# EAGLE design lunchbeats - amp (EAGLE 6.1)
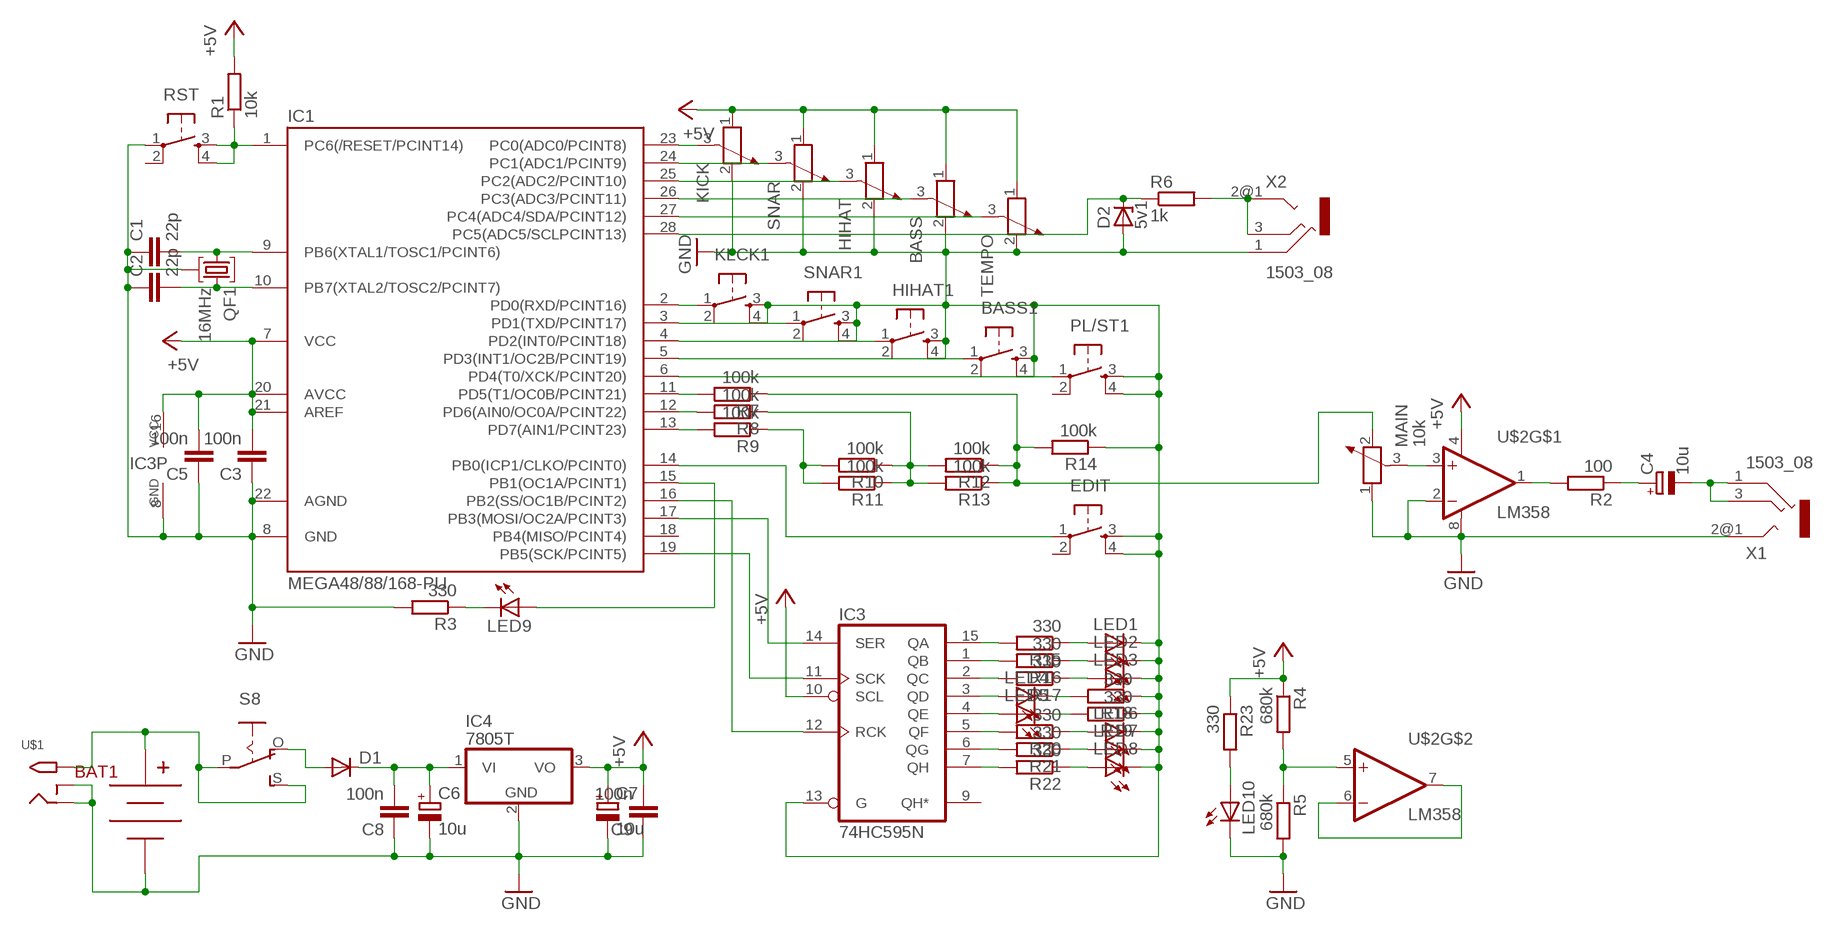
[diagram p0: schematic, sheet 1]

## Parts
BASS  POTENTIOMETER_PT-10  [PT-10]
BASS1  TAC_SWITCHPTH  [TACTILE-PTH]
BAT1  BC9VPC  [BC9VPC]
C1  22p  C-EU025-025X050  [C025-025X050]
C2  22p  C-EU025-025X050  [C025-025X050]
C3  100n  C-EU025-025X050  [C025-025X050]
C4  10u  CPOL-EUE2.5-6  [E2,5-6]
C5  100n  C-EU025-025X050  [C025-025X050]
C6  10u  CPOL-EUE2.5-5  [E2,5-5]
C7  10u  CPOL-EUE2.5-5  [E2,5-5]
C8  100n  C-EU025-025X050  [C025-025X050]
C9  100n  C-EU025-025X050  [C025-025X050]
D1  DIODE-D-5  [D-5]
D2  5v1  ZENER-DIODEZD-2.5  [ZDIO-2.5]
EDIT  TAC_SWITCHPTH  [TACTILE-PTH]
HIHAT  POTENTIOMETER_PT-10  [PT-10]
HIHAT1  TAC_SWITCHPTH  [TACTILE-PTH]
IC1  MEGA48/88/168-PU  [DIL28-3]
IC3  74HC595N  [DIL16]
IC4  7805T  [TO220H]
KICK  POTENTIOMETER_PT-10  [PT-10]
KLCK1  TAC_SWITCHPTH  [TACTILE-PTH]
LED1  LED5MM  [LED5MM]
LED2  LED5MM  [LED5MM]
LED3  LED5MM  [LED5MM]
LED4  LED5MM  [LED5MM]
LED5  LED5MM  [LED5MM]
LED6  LED5MM  [LED5MM]
LED7  LED5MM  [LED5MM]
LED8  LED5MM  [LED5MM]
LED9  LED5MM  [LED5MM]
LED10  LED5MM  [LED5MM]
MAIN  10k  POTENTIOMETER_PT-10  [PT-10]
PL/ST1  TAC_SWITCHPTH  [TACTILE-PTH]
QF1  16MHz  8M10AHC49T  [HC49U]
R1  10k  R-EU_0204/7  [0204/7]
R2  100  R-EU_0204/7  [0204/7]
R3  330  R-EU_0204/7  [0204/7]
R4  680k  R-EU_0204/5  [0204/5]
R5  680k  R-EU_0204/7  [0204/7]
R6  1k  R-EU_0204/7  [0204/7]
R7  100k  R-EU_0204/7  [0204/7]
R8  100k  R-EU_0204/7  [0204/7]
R9  100k  R-EU_0204/7  [0204/7]
R10  100k  R-EU_0204/7  [0204/7]
R11  100k  R-EU_0204/7  [0204/7]
R12  100k  R-EU_0204/7  [0204/7]
R13  100k  R-EU_0204/7  [0204/7]
R14  100k  R-EU_0204/7  [0204/7]
R15  330  R-EU_0204/7  [0204/7]
R16  330  R-EU_0204/7  [0204/7]
R17  330  R-EU_0204/7  [0204/7]
R18  330  R-EU_0204/7  [0204/7]
R19  330  R-EU_0204/7  [0204/7]
R20  330  R-EU_0204/7  [0204/7]
R21  330  R-EU_0204/7  [0204/7]
R22  330  R-EU_0204/7  [0204/7]
R23  330  R-EU_0204/5  [0204/5]
RST  TAC_SWITCHPTH  [TACTILE-PTH]
S8  EG1218S  [EG1218]
SNAR  POTENTIOMETER_PT-10  [PT-10]
SNAR1  TAC_SWITCHPTH  [TACTILE-PTH]
TEMPO  POTENTIOMETER_PT-10  [PT-10]
U$1  2.1MMJACKTHM  [PJ-102A]
U$2  LM358  [DIP08]
X1  1503_08  [1503_08]
X2  1503_08  [1503_08]

## Nets
+5V: BASS.1 C3.2 C5.2 C7.+ C9.2 HIHAT.1 IC1.7(VCC) IC1.20(AVCC) IC1.21(AREF) IC3.10(SCL) IC3.16(VCC) IC4.3(VO) KICK.1 R1.2 R4.1 R23.1 SNAR.1 TEMPO.1 U$2.4(V-)
GND: BASS1.3 BASS1.4 BASS.2 BAT1.V- C1.1 C2.1 C3.1 C5.1 C6.- C7.- C8.1 C9.1 D2.A EDIT.3 EDIT.4 HIHAT1.3 HIHAT1.4 HIHAT.2 IC1.8(GND) IC1.22(AGND) IC3.8(GND) IC3.13(G) IC4.2(GND) KICK.2 KLCK1.3 KLCK1.4 LED1.K(C) LED2.K(C) LED3.K(C) LED6.K(C) LED7.K(C) LED8.K(C) LED10.K(C) MAIN.1 PL/ST1.3 PL/ST1.4 QF1.2 R3.2 R5.2 R14.1 R18.1 R19.1 RST.1 SNAR1.3 SNAR1.4 SNAR.2 TEMPO.2 U$1.RING U$1.RING_SW U$2.2(-IN) U$2.8(V+) X1.2@1 X2.1
N$1: C1.2 IC1.9(PB6(XTAL1/TOSC1/PCINT6)) QF1.1
N$2: C2.2 IC1.10(PB7(XTAL2/TOSC2/PCINT7)) QF1.3
N$3: IC1.2(PD0(RXD/PCINT16)) KLCK1.1
N$4: IC3.3(QD) LED4.A
N$5: IC1.1(PC6(/RESET/PCINT14)) R1.1 RST.3 RST.4
N$6: IC1.23(PC0(ADC0/PCINT8)) KICK.3
N$7: IC1.24(PC1(ADC1/PCINT9)) SNAR.3
N$8: HIHAT.3 IC1.25(PC2(ADC2/PCINT10))
N$9: BASS.3 IC1.26(PC3(ADC3/PCINT11))
N$10: IC1.27(PC4(ADC4/SDA/PCINT12)) TEMPO.3
N$11: LED4.K(C) R18.2
N$12: IC3.4(QE) LED5.A
N$13: LED5.K(C) R19.2
N$14: R2.2 U$2.1(OUT)
N$15: IC1.11(PD5(T1/OC0B/PCINT21)) R7.2
N$16: IC1.12(PD6(AIN0/OC0A/PCINT22)) R8.2
N$17: IC1.13(PD7(AIN1/PCINT23)) R9.2
N$18: R9.1 R10.2 R11.2
N$19: R8.1 R10.1 R11.1 R12.2 R13.2
N$20: MAIN.2 R7.1 R12.1 R13.1 R14.2
N$21: EDIT.1 IC1.14(PB0(ICP1/CLKO/PCINT0))
N$22: C4.+ R2.1
N$23: IC3.15(QA) R15.2
N$24: IC3.1(QB) R16.2
N$25: IC3.2(QC) R17.2
N$26: MAIN.3 U$2.3(+IN)
N$27: C4.- X1.1 X1.3
N$28: IC3.5(QF) R20.2
N$29: IC3.6(QG) R21.2
N$30: IC3.7(QH) R22.2
N$31: LED1.A R15.1
N$32: LED2.A R16.1
N$33: LED3.A R17.1
N$34: IC1.15(PB1(OC1A/PCINT1)) LED9.A
N$35: LED9.K(C) R3.1
N$36: LED6.A R20.1
N$37: LED7.A R21.1
N$38: LED8.A R22.1
N$39: IC1.3(PD1(TXD/PCINT17)) SNAR1.1
N$40: HIHAT1.1 IC1.4(PD2(INT0/PCINT18))
N$41: IC1.17(PB3(MOSI/OC2A/PCINT3)) IC3.14(SER)
N$42: IC1.19(PB5(SCK/PCINT5)) IC3.11(SCK)
N$43: IC1.16(PB2(SS/OC1B/PCINT2)) IC3.12(RCK)
N$44: BASS1.1 IC1.5(PD3(INT1/OC2B/PCINT19))
N$45: C6.+ C8.2 D1.C IC4.1(VI)
N$46: BAT1.V+ S8.P S8.S U$1.TIP
N$47: D1.A S8.O
N$48: IC1.6(PD4(T0/XCK/PCINT20)) PL/ST1.1
N$49: R6.2 X2.2@1 X2.3
N$50: R4.2 R5.1 U$2.5(+IN)
N$51: U$2.6(-IN) U$2.7(OUT)
N$52: D2.C IC1.28(PC5(ADC5/SCLPCINT13)) R6.1
N$56: LED10.A R23.2
Unconnected: BASS1.2 EDIT.2 HIHAT1.2 IC1.18(PB4(MISO/PCINT4)) IC3.9(QH*) KLCK1.2 PL/ST1.2 RST.2 SNAR1.2 X1.2@2 X2.2@2

## Library data of the parts
BASS HIHAT KICK MAIN SNAR TEMPO = rcl:POTENTIOMETER_: Potentiometer
BASS1 EDIT HIHAT1 KLCK1 PL/ST1 RST SNAR1 = SparkFun-Electromechanical:TAC_SWITCH: Momentary Switch Button commonly used for reset or general input. Spark Fun Electronics SKU : COM-00097 SMT- SWCH-08247
BAT1 = SparkFun-Connectors:BC9VPC: 9V board-mount battery cradle
C1-C3 C5 C8 C9 = rcl:C-EU: CAPACITOR, European symbol
C4 C6 C7 = rcl:CPOL-EU: POLARIZED CAPACITOR, European symbol
D1 = diode:DIODE-: DIODE
D2 = diode:ZENER-DIODE: Z-Diode
IC1 = avr-5:MEGA48/88/168-PU
IC3 = 74xx-eu:74*595: 8-bit SHIFT REGISTER, output latch
IC4 = adafruit:78*: Positive VOLTAGE REGULATOR Added bigger pads to the TO-92 package
LED1-LED10 = led:LED: LED OSRAM: - CHIPLED LG R971, LG N971, LY N971, LG Q971, LY Q971, LO R971, LY R971 LH N974, LH R974 LS Q976, LO Q976, LY Q976 LO Q996 - Hyper CHIPLED LW Q18S LB Q993, LB Q99A, LB R99A - SideLED LS A670, LO A670, LY A670, LG A670, LP A670 LB A673, LV A673, LT A673, LW A673 LH A674 LY A675 LS A676, LA A676, LO A676, LY A676, LW A676 LS A679, LY A679, LG A679 - Hyper Micro SIDELED® LS Y876, LA Y876, LO Y876, LY Y876 LT Y87S - SmartLED LW L88C, LW L88S LB L89C, LB L89S, LG L890 LS L89K, LO L89K, LY L89K LS L896, LA L896, LO L896, LY L896 - TOPLED LS T670, LO T670, LY T670, LG T670, LP T670 LSG T670, LSP T670, LSY T670, LOP T670, LYG T670 LG T671, LOG T671, LSG T671 LB T673, LV T673, LT T673, LW T673 LH T674 LS T676, LA T676, LO T676, LY T676, LB T676, LH T676, LSB T676, LW T676 LB T67C, LV T67C, LT T67C, LS T67K, LO T67K, LY T67K, LW E67C LS E67B, LA E67B, LO E67B, LY E67B, LB E67C, LV E67C, LT E67C LW T67C LS T679, LY T679, LG T679 LS T770, LO T770, LY T770, LG T770, LP T770 LB T773, LV T773, LT T773, LW T773 LH T774 LS E675, LA E675, LY E675, LS T675 LS T776, LA T776, LO T776, LY T776, LB T776 LHGB T686 LT T68C, LB T68C - Hyper Mini TOPLED® LB M676 - Mini TOPLED Santana® LG M470 LS M47K, LO M47K, LY M47K Source: http://www.osram.convergy.de LUXEON: - LUMILED® LXK2-PW12-R00, LXK2-PW12-S00, LXK2-PW14-U00, LXK2-PW14-V00 LXK2-PM12-R00, LXK2-PM12-S00, LXK2-PM14-U00 LXK2-PE12-Q00, LXK2-PE12-R00, LXK2-PE12-S00, LXK2-PE14-T00, LXK2-PE14-U00 LXK2-PB12-K00, LXK2-PB12-L00, LXK2-PB12-M00, LXK2-PB14-N00, LXK2-PB14-P00, LXK2-PB14-Q00 LXK2-PR12-L00, LXK2-PR12-M00, LXK2-PR14-Q00, LXK2-PR14-R00 LXK2-PD12-Q00, LXK2-PD12-R00, LXK2-PD12-S00 LXK2-PH12-R00, LXK2-PH12-S00 LXK2-PL12-P00, LXK2-PL12-Q00, LXK2-PL12-R00 Source: www.luxeon.com KINGBRIGHT: KA-3528ASYC Source: www.kingbright.com
QF1 = crystal:8M10AHC49T: Monolithic Crystal Filters Source: www.vanlong.com; OC_FARNELL: unknown; OC_NEWARK: unknown
R1-R23 = rcl:R-EU_: RESISTOR, European symbol
S8 = adafruit:EG1218: SLIDING SWITCH 0.1" spacing through hole, vertical SPDT slide switch http://www.ladyada.net/library/pcb/eaglelibrary.html
U$1 = adafruit:2.1MMJACK: 2.1mm x 5.5mm THM DC jack with internal switch. Digikey part #PJ-102A, 4UCON part #05537 2.1mm x 5.5mm SMT DC jack with internal switch. Digikey part #PJ-002A-SMT, 4UCON part #03267 By microbuilder.eu & adafruit.com
U$2 = SparkFun:LM358
X1 X2 = con-lumberg:1503_?: Jack connectors according to JISC 6560, 3.5 mm Klinkensteckverbinder nach JISC 6560, 3,5 mm Source: http://www.lumberg.com/Produkte/PDFs/1503_08.pdf; OC_FARNELL: unknown; OC_NEWARK: unknown

## Board
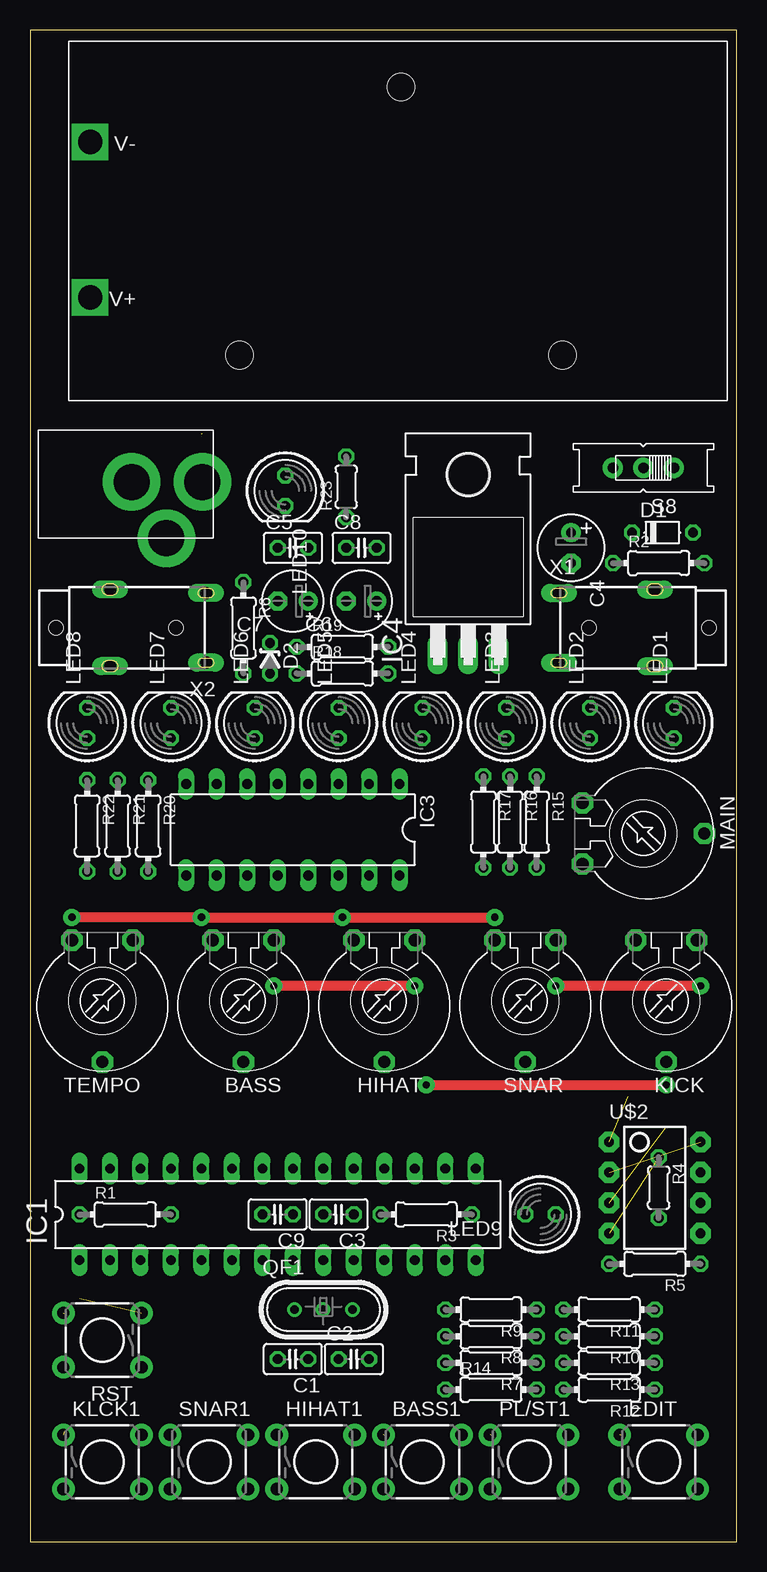
[diagram p1: board, top side]
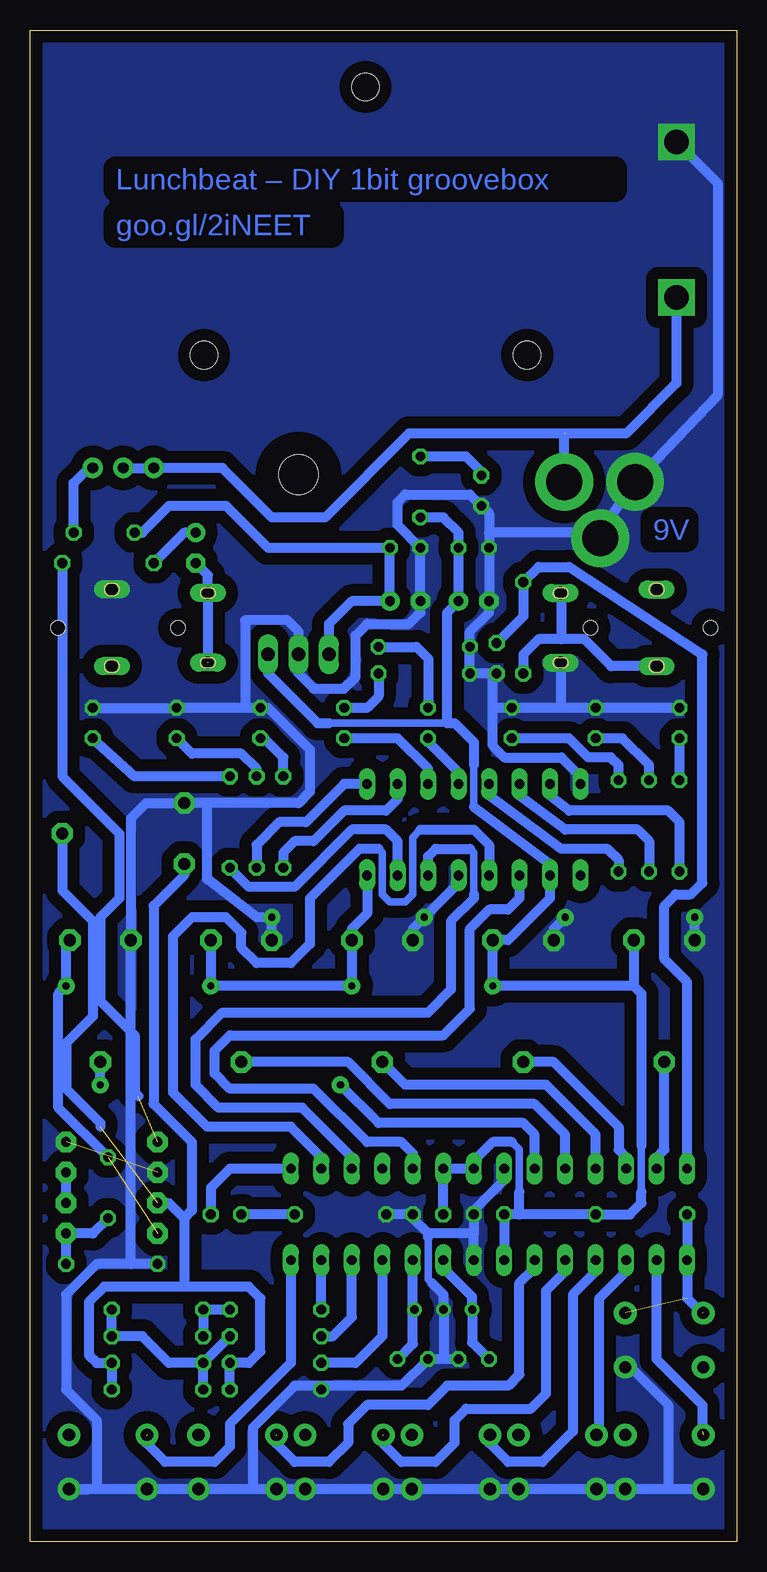
[diagram p2: board, bottom side, seen from below]

Size 58.89 x 126.03 mm. Coordinates in mm from the lower left corner, seen from the top.
Outline: 0,0 58.89,0 58.89,126.03 0,126.03 0,0
Copper layers (1*16): Top 0.035mm / dielectric 1.5mm / Bottom 0.035mm
Design rules: minimum track width 10mil, minimum drill 24mil, track to track 12mil, track to pad 12mil, pad to pad 12mil, via to via 12mil, smd to smd 10mil, copper to edge 12mil, drill to drill 12mil, minimum pad ring 10mil, minimum via ring 10mil, stop-mask expansion 4mil, vias tented up to drill 0mil, thermal gap 12mil

### Footprints (pad centres in the part's own frame; a part is rotated, then mirrored left to right if it is on the bottom)
PT-10 = drill 1.016 pad 1.778 octagon: 1 -2.54,-5.08; 2 2.54,-5.08; 3 0,5.08
TACTILE-PTH = drill 1.016 pad 1.88: 1 -3.251,2.261; 2 3.251,2.261; 3 -3.251,-2.261; 4 3.251,-2.261
BC9VPC = drill 2.032 square: V+ 53.086,21.336; V- 53.086,8.382 | hole 2.286: 27.178,3.81; 13.716,26.162; 40.64,26.162
C025-025X050 = drill 0.813 octagon: 1 -1.27,0; 2 1.27,0
E2,5-6 = drill 0.813 pad 1.6: + -1.27,0 | drill 0.813 pad 1.6 octagon: - 1.27,0
E2,5-5 = drill 0.813 pad 1.6: + -1.27,0 | drill 0.813 pad 1.6 octagon: - 1.27,0
D-5 = drill 0.813 octagon: A 2.54,0; C -2.54,0
ZDIO-2.5 = drill 0.813 octagon: A 1.27,0; C -1.27,0
DIL28-3 = drill 0.813 long: 1 -16.51,-3.81; 2 -13.97,-3.81; 3 -11.43,-3.81; 4 -8.89,-3.81; 5 -6.35,-3.81; 6 -3.81,-3.81; 7 -1.27,-3.81; 8 1.27,-3.81; 9 3.81,-3.81; 10 6.35,-3.81; 11 8.89,-3.81; 12 11.43,-3.81; 13 13.97,-3.81; 14 16.51,-3.81; 15 16.51,3.81; 16 13.97,3.81; 17 11.43,3.81; 18 8.89,3.81; 19 6.35,3.81; 20 3.81,3.81; 21 1.27,3.81; 22 -1.27,3.81; 23 -3.81,3.81; 24 -6.35,3.81; 25 -8.89,3.81; 26 -11.43,3.81; 27 -13.97,3.81; 28 -16.51,3.81
DIL16 = drill 0.813 long: 1 -8.89,-3.81; 2 -6.35,-3.81; 3 -3.81,-3.81; 4 -1.27,-3.81; 5 1.27,-3.81; 6 3.81,-3.81; 7 6.35,-3.81; 8 8.89,-3.81; 9 8.89,3.81; 10 6.35,3.81; 11 3.81,3.81; 12 1.27,3.81; 13 -1.27,3.81; 14 -3.81,3.81; 15 -6.35,3.81; 16 -8.89,3.81
TO220H = drill 1.118 long: 1 -2.54,-10.16; 2 0,-10.16; 3 2.54,-10.16 | hole 3.302: 0,4.826
LED5MM = drill 0.813 octagon: A -1.27,0; K 1.27,0
HC49U = drill 0.7 pad 1.2: 1 -2.413,0; 2 -0.027,0; 3 2.413,0
0204/7 = drill 0.813 octagon: 1 -3.81,0; 2 3.81,0
0204/5 = drill 0.813 octagon: 1 -2.54,0; 2 2.54,0
EG1218 = drill 0.9 pad 1.676: O -2.54,0; P 0,0; S 2.54,0
PJ-102A = drill 3 pad 4.8: RING 0.1,-3.39; RING_SW -4.6,-6.29; TIP 0.1,-9.29
DIP08 = drill 0.813 pad 1.727 octagon: 1 -3.81,-3.81; 2 -1.27,-3.81; 3 1.27,-3.81; 4 3.81,-3.81; 5 3.81,3.81; 6 1.27,3.81; 7 -1.27,3.81; 8 -3.81,3.81
1503_08 = drill 1 pad 1.2 long: 1 -2.9,-8; 2@1 -3.2,0; 2@2 3.2,0; 3 2.9,-8 | hole 1.2: 0,4.5; 0,-5.5

### Placement (x,y rotation side)
BASS  17.78,45.09 180 top
BASS1  32.7,6.67 0 top
BAT1  58.1,125.09 180 top
C1  21.91,15.24 180 top
C2  26.99,15.24 0 top
C3  25.72,27.3 180 top
C4  45.09,82.87 270 top
C5  21.91,82.87 0 top
C6  27.62,78.42 180 top
C7  21.91,78.42 180 top
C8  27.62,82.87 0 top
C9  20.64,27.3 180 top
D1  52.7,84.14 0 top
D2  20,73.66 270 top
EDIT  52.39,6.67 0 top
HIHAT  29.53,45.09 180 top
HIHAT1  23.81,6.67 0 top
IC1  20.64,27.3 0 top
IC3  21.91,59.37 180 top
IC4  36.51,84.14 0 top
KICK  53.02,45.09 180 top
KLCK1  6.03,6.67 0 top
LED1  53.66,68.26 90 top
LED2  46.67,68.26 90 top
LED3  39.69,68.26 90 top
LED4  32.7,68.26 90 top
LED5  25.72,68.26 90 top
LED6  18.73,68.26 90 top
LED7  11.75,68.26 90 top
LED8  4.76,68.26 90 top
LED9  42.55,27.3 180 top
LED10  21.27,87.63 270 top
MAIN  51.12,59.05 270 top
PL/ST1  41.59,6.67 0 top
QF1  24.45,19.37 0 top
R1  7.94,27.3 0 top
R2  52.39,81.6 0 top
R3  33.02,27.3 180 top
R4  52.39,29.53 270 top
R5  52.07,23.18 180 top
R6  17.78,76.2 270 top
R7  38.42,14.92 180 top
R8  38.42,17.14 180 top
R9  38.42,19.37 180 top
R10  48.26,17.14 180 top
R11  48.26,19.37 180 top
R12  48.26,12.7 180 top
R13  48.26,14.92 180 top
R14  38.42,12.7 0 top
R15  42.23,60.01 270 top
R16  40.01,60.01 270 top
R17  37.78,60.01 270 top
R18  26.04,72.39 0 top
R19  26.04,74.61 0 top
R20  9.84,59.69 270 top
R21  7.3,59.69 270 top
R22  4.76,59.69 270 top
R23  26.35,87.95 90 top
RST  6.03,16.83 180 top
S8  51.12,89.53 180 top
SNAR  41.27,45.09 180 top
SNAR1  14.92,6.67 0 top
TEMPO  6.03,45.09 180 top
U$1  5.08,88.27 90 top
U$2  52.07,29.53 270 top
X1  52.07,76.2 270 top
X2  6.67,76.2 90 top

### Tracks (layer width: path | path; a pad name or v marks a point on that pad's centre or on a via)
+5V  (via drill 0.6 pad 1.42)  (1 unrouted)
  Top 0.813: v55.88,46.35 v43.81,46.35 | v32.07,46.35 v20.32,46.35
  Bottom 0.61: 21.91,64.77 21.91,61.28 | 18.1,29.21 18.1,32.7 18.73,33.34 | 7.94,33.02 7.94,29.21 | 33.97,68.26 24.13,68.26
  Bottom 0.813: IC3.16 30.8,52.39 32.07,51.12 HIHAT.1 v32.07,46.35 v43.81,46.35 SNAR.1 | 21.91,61.28 15.56,56.52 IC3.10 15.56,53.66 19.05,50.16 BASS.1 v20.32,46.35 8.57,46.35 | C3.2 IC1.20 IC1.21 21.91,31.75 20.32,33.34 18.73,33.34 | KICK.1 55.88,49.85 v55.88,46.35 56.52,45.72 56.52,36.2 R4.1 | R1.2 18.1,27.3 | 7.94,29.21 7.94,28.26 8.89,27.3 R1.2 | IC4.3 39.05,72.39 34.92,68.26 33.97,68.26 | 21.91,64.77 21.91,66.67 23.5,68.26 24.13,68.26 24.13,77.47 C7.+ C5.2 23.18,84.14 24.45,85.41 R23.1 | IC1.7 C9.2 18.1,27.3 | 18.1,27.3 18.1,29.21 | 7.94,33.02 7.94,45.72 8.57,46.35 | R1.2 12.06,27.3 | TEMPO.1 8.57,46.35
GND  (via drill 0.6 pad 1.42)  (1 unrouted)
  Top 0.813: v38.73,52.07 v26.04,52.07 v14.29,52.07 v3.49,52.07
  Bottom 0.61: 25.72,25.4 25.72,21.91 25.4,21.59
  Bottom 0.813: LED8.K LED7.K 14.61,69.53 | 14.61,69.53 LED6.K 20.32,69.53 | 40.96,69.53 LED3.K 39.05,69.53 35.56,66.04 35.56,62.55 36.51,61.59 44.13,61.59 | 40.96,69.53 LED2.K LED1.K | 24.42,15.27 QF1.2 24.42,20.61 25.4,21.59 | 24.42,15.27 24.77,15.24 C2.1 27.94,13.02 34.61,13.02 | C1.1 24.39,15.24 24.42,15.27 | SNAR.2 v38.73,52.07 40.01,52.07 44.13,55.24 44.13,61.59 | IC3.8 13.02,63.82 14.61,65.41 19.37,65.41 20.32,66.36 20.32,69.53 | IC3.13 23.18,54.93 v26.04,52.07 26.99,51.12 HIHAT.2 | 25.72,25.4 25.72,25.72 | IC1.8 21.91,25.72 | 21.91,25.72 25.72,25.72 | 50.48,23.18 KICK.2 50.48,60.33 49.21,61.59 MAIN.1 44.13,61.59 | v14.29,52.07 15.24,51.12 BASS.2 | 40.96,69.53 40.96,76.83 37.47,76.83 36.51,75.88 IC4.2 36.51,72.39 35.24,71.12 32.7,71.12 31.75,72.07 31.75,75.56 30.8,76.52 27.3,76.52 26.35,77.47 C6.- C8.1 28.26,84.77 28.26,86.68 27.62,87.31 22.23,87.31 LED10.K 20.64,85.72 20.64,84.14 | BAT1.V- 1.59,113.28 1.59,95.56 U$1.RING 11.43,84.14 20.64,84.14 | 34.61,13.02 36.83,13.02 40.32,9.53 40.32,4.41 | 20.64,84.14 C5.1 C7.- 20.64,77.47 22.23,75.88 R19.1 R18.1 D2.A 20.32,72.07 20.32,69.53 | IC1.22 19.37,30.16 21.91,27.62 C9.1 21.91,25.72 | X2.1 14.67,69.59 14.61,69.53 | R5.2 50.48,23.18 | 50.48,23.18 53.34,23.18 55.88,20.64 55.88,12.7 53.34,10.16 53.34,4.45 54.01,4.41 EDIT.4 EDIT.3 PL/ST1.4 40.32,4.41 | KLCK1.3 5.71,4.41 | 5.71,4.41 KLCK1.4 SNAR1.3 SNAR1.4 HIHAT1.3 HIHAT1.4 BASS1.3 BASS1.4 PL/ST1.3 40.32,4.41 | 5.71,4.41 5.71,11.43 8.97,14.68 RST.1 | R14.1 34.61,13.02 | 25.72,25.72 26.99,26.99 C3.1 R3.2 | TEMPO.2 v3.49,52.07
  pour Bottom (isolate 1.016, no thermals): 0,0 58.74,0 58.74,126.05 0,126.05
N$1
  Bottom 0.813: C1.2 22.04,16.64 QF1.1 22.04,20.45 24.45,22.86 IC1.9
N$2
  Bottom 0.813: C2.2 26.99,16.51 26.99,19.37 | 26.99,19.37 IC1.10 | QF1.3 26.99,19.37
N$3  (1 unrouted)
  Bottom 0.813: IC1.2 6.67,15.24 2.86,11.43 2.86,9.21
N$4
  Bottom 0.813: LED4.A 28.26,66.99 25.72,64.45 IC3.3
N$5  (2 unrouted)
  Bottom 0.813: R1.1 IC1.1 | 4.09,23.46 IC1.1 | IC1.1 4.13,20.32 2.86,19.05
N$6  (via drill 0.6 pad 1.42)
  Top 0.813: v33.02,38.1 v53.02,38.1
  Bottom 0.813: v53.02,38.1 KICK.3 | IC1.23 16.83,33.97 17.78,34.92 29.84,34.92 v33.02,38.1
N$7
  Bottom 0.813: SNAR.3 32.38,40.01 28.89,36.51 16.83,36.51 14.29,33.97 IC1.24
N$8
  Bottom 0.813: IC1.25 11.75,33.97 15.88,38.1 27.62,38.1 HIHAT.3
N$9
  Bottom 0.813: BASS.3 15.24,40.01 9.84,34.61 9.84,32.7 9.21,32.07 IC1.26
N$10
  Bottom 0.813: IC1.27 6.67,32.07 6.03,32.7 TEMPO.3
N$11
  Bottom 0.813: R18.2 29.84,70.48 30.8,69.53 LED4.K
N$12
  Bottom 0.813: IC3.4 23.18,64.14 25.72,66.67 LED5.A
N$13
  Bottom 0.813: R19.2 26.67,74.61 25.72,73.66 LED5.K
N$14  (1 unrouted)
  Bottom 0.813: R2.2 56.2,63.82 51.44,59.05 51.44,53.66 53.02,52.07 53.02,45.09 50.16,42.23 50.16,37.47 49.85,37.15
N$15
  Bottom 0.813: IC1.11 29.53,17.14 31.75,14.92 R7.2
N$16
  Bottom 0.813: R8.2 33.66,17.14 32.07,18.73 IC1.12
N$17
  Bottom 0.813: R9.2 IC1.13
N$18
  Bottom 0.813: R10.2 R11.2 R9.1
N$19
  Bottom 0.813: R12.2 R13.2 | R8.1 R13.2 | R13.2 47.31,14.92 49.53,17.14 R10.1 R11.1
N$20
  Bottom 0.813: R12.1 R13.1 53.34,14.92 53.98,15.56 53.98,20 52.7,21.27 46.04,21.27 | R14.2 R7.1 40.64,14.92 39.69,15.88 39.69,20.32 40.64,21.27 46.04,21.27 | 47.31,28.26 46.04,26.99 | 46.04,26.99 46.04,21.27 | MAIN.2 46.04,55.56 48.58,53.02 48.58,36.51 45.4,33.34 45.4,27.62 46.04,26.99
N$21  (1 unrouted)
  Bottom 0.813: 49.21,8.89 49.21,8.26 47.62,6.67 43.5,6.67 42.23,7.94 42.23,9.84 37.15,14.92 IC1.14
N$22
  Bottom 0.813: C4.+ 46.04,84.14 R2.1
N$23
  Bottom 0.813: IC3.15 28.26,58.42 29.21,59.37 32.07,59.37 36.83,54.61 40.64,54.61 R15.2
N$24
  Bottom 0.813: IC3.1 32.7,63.18 35.88,60.01 38.1,60.01 40.01,58.1 R16.2
N$25
  Bottom 0.813: IC3.2 28.26,61.91 29.21,60.96 32.7,60.96 35.24,58.42 36.83,58.42 37.78,57.47 R17.2
N$26  (1 unrouted)
  Bottom 0.813: MAIN.3 56.2,54.29 53.66,51.75 53.66,43.81 55.88,41.59 55.88,37.78 53.02,34.92 53.02,34.61
N$27  (1 unrouted)
  Bottom 0.813: C4.- 44.07,80.58 X1.1 44.07,73.41 44.13,73.34
N$28
  Bottom 0.813: IC3.5 20.64,62.23 14.61,57.78 10.79,57.78 9.84,56.83 R20.2
N$29
  Bottom 0.813: IC3.6 18.1,62.23 14.29,59.37 8.26,59.37 7.3,58.42 R21.2
N$30
  Bottom 0.813: R22.2 4.76,60.01 5.71,60.96 13.97,60.96 15.56,62.23 IC3.7
N$31
  Bottom 0.813: LED1.A 50.16,63.82 R15.1
N$32
  Bottom 0.813: LED2.A 45.4,65.72 41.27,65.72 40.01,64.45 R16.1
N$33
  Bottom 0.813: R17.1 37.78,65.41 39.37,66.99 LED3.A
N$34
  Bottom 0.813: IC1.15 42.23,31.11 43.81,29.53 LED9.A
N$35
  Bottom 0.813: R3.1 LED9.K
N$36
  Bottom 0.813: LED6.A 13.97,66.99 12.38,65.41 10.48,65.41 9.84,64.77 R20.1
N$37
  Bottom 0.813: R21.1 7.3,64.77 9.53,66.99 LED7.A
N$38
  Bottom 0.813: R22.1 LED8.A
N$39
  Bottom 0.813: IC1.3 9.21,22.54 11.43,20.32 11.43,9.21 11.67,8.97 SNAR1.1
N$40
  Bottom 0.813: IC1.4 11.75,22.54 13.65,20.64 13.65,9.21 16.19,6.67 19.05,6.67 20.64,8.26 20.64,8.85 HIHAT1.1
N$41
  Bottom 0.61: 21.91,53.98 21.91,57.47 22.23,57.78
  Bottom 0.813: IC1.17 32.07,32.07 36.2,36.2 43.18,36.2 45.09,38.1 45.09,41.91 42.86,44.13 25.72,44.13 23.81,46.04 23.81,51.75 21.91,53.66 21.91,53.98 | IC3.14 25.72,57.15 25.08,57.78 22.23,57.78
N$42
  Bottom 0.813: IC3.11 18.1,53.66 19.05,52.7 20.64,52.7 22.23,51.12 22.23,44.45 24.45,42.23 42.23,42.23 43.5,40.96 43.5,39.05 42.23,37.78 35.24,37.78 30.8,33.34 27.94,33.34 26.99,32.38 IC1.19
N$43
  Bottom 0.61: 29.84,57.78 29.53,57.47 29.53,53.98 28.89,53.34 27.62,53.34 26.99,53.98 26.99,58.74 26.35,59.37
  Bottom 0.813: 26.35,59.37 21.91,59.37 20.64,58.1 IC3.12 | 29.84,57.78 31.43,57.78 35.56,53.66 35.56,49.85 37.15,48.26 40.01,48.26 41.27,49.53 41.27,50.8 42.55,52.07 45.4,52.07 46.99,50.48 46.99,37.47 44.13,34.61 37.15,34.61 34.61,32.07 IC1.16
N$44  (1 unrouted)
  Bottom 0.813: IC1.5 14.29,22.54 15.88,20.95 15.88,12.38 17.14,11.11 22.54,11.11 23.5,10.16 23.5,8.26 25.08,6.67 27.94,6.67 29.53,8.26 29.53,8.89
N$45
  Bottom 0.813: D1.C 49.53,84.14 47.31,86.36 42.55,86.36 39.05,82.87 C8.2 C6.+ 32.07,78.42 33.97,76.52 IC4.1
N$46  (1 unrouted)
  Bottom 0.813: S8.P S8.S 42.86,89.53 38.73,85.41 34.29,85.41 27.3,92.39 14.37,92.39 U$1.TIP | BAT1.V+ 5.02,96.58 9.21,92.39 14.29,92.39
N$47
  Bottom 0.813: D1.A 55.24,88.27 53.98,89.53 S8.O
N$48  (1 unrouted)
  Bottom 0.813: IC1.6 16.83,22.86 18.1,21.59 18.1,13.97 19.05,13.02 24.13,13.02 25.72,11.43 30.8,11.43 32.38,9.84 32.38,8.26 33.97,6.67 36.83,6.67 38.42,8.26 38.42,8.89
N$49
  Bottom 0.813: X2.2@1 10.45,73 12.7,75.25 14.61,75.25 | 14.61,75.25 16.51,75.25 17.78,73.98 R6.2 | X2.3 14.65,79.1 14.61,79.06 14.61,75.25
N$50
  Bottom 0.813: R5.1 U$2.5 53.66,25.72 R4.2
N$51
  Bottom 0.813: U$2.6 U$2.7
N$52
  Bottom 0.813: IC1.28 4.13,46.67 6.03,48.58 6.03,53.02 5.08,53.98 3.81,53.98 2.86,54.93 2.86,73.98 13.97,81.28 16.51,81.28 R6.1 17.78,77.15 D2.C
N$56
  Bottom 0.813: LED10.A 21.27,89.22 22.54,90.49 R23.2

### Text on the board
Bottom: Lunchbeat – DIY 1bit groovebox | goo.gl/2iNEET | 9V